# Altium schematic sheet Tarjeta_SD_Interfaz.SchDoc: MSP430F5529_uSD_CARD_Interface
size A4; Date: 13.06.2011; Author: ROUX, Federico G. (rouxfederico@gmail.com); CompanyName: Neróx; DrawnBy: ROUX, Federico G.(rouxfederico@gmail.com); Engineer: ALMARK, Aarón; Organization: Neróx; DocumentNumber: 3; Revision: 1.2; SheetNumber: 3; SheetTotal: 7; ModifiedDate: 25.10.2011; ProjectName: AySA
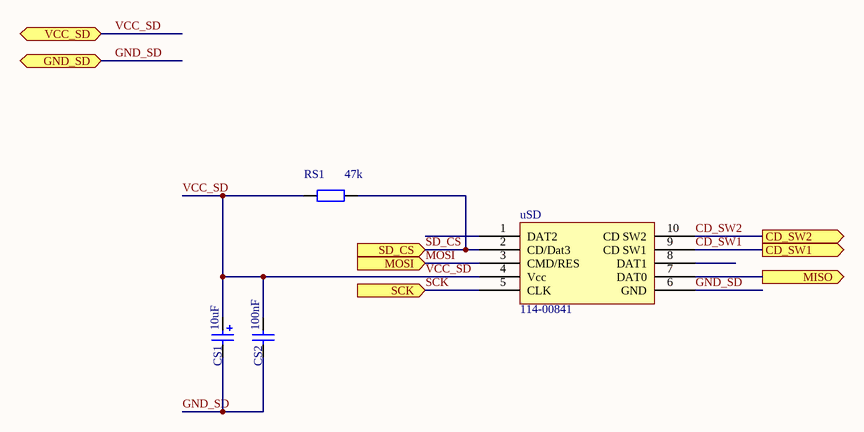
[diagram p0: Tarjeta_SD_Interfaz.SchDoc]

## Parts
CS1  value 10uF  [6-0805_M]  (hidden comment: Cap Pol3)
CS2  value 100nF  [6-0805_M]  (hidden comment: Cap)
RS1  value 47k  [6-0805_M]  (hidden comment: Res2)
uSD  114-00841  [Amphenol 114-00841-68]

## Ports
CD_SW1 (out), CD_SW2 (out), GND_SD, MISO (out), MOSI (in), SCK (in), SD_CS (in), VCC_SD

## Nets
CD_SW1: uSD.9(CD_SW1) ; port CD_SW1
CD_SW2: uSD.10(CD_SW2) ; port CD_SW2
GND_SD: CS1.2 CS2.1 uSD.6(GND) ; port GND_SD
MISO: uSD.7(DAT0) ; port MISO
MOSI: uSD.3(CMD/RES) ; port MOSI
SCK: uSD.5(CLK) ; port SCK
SD_CS: RS1.2 uSD.2(CD/Dat3) ; port SD_CS
VCC_SD: CS1.1 CS2.2 RS1.1 uSD.4(Vcc) ; port VCC_SD

Not connected (* = marked no-connect by the designer): uSD 1(DAT2) 8(DAT1)

## Library data of the parts
CS1 = Cap Pol3: Polarized Capacitor (SMD); Published: 8-Jun-2000; Revision: July-2002: Re-released for DXP Platform.; Publisher: Altium Limited
CS2 = Cap Semi: Capacitor (SMD); Published: 8-Jun-2000; Revision: July-2002: Re-released for DXP Platform.; Publisher: Altium Limited
RS1 = Res2: Resistor(0805 - SMD); Published: 8-Jun-2000; LatestRevisionDate: 17-Jul-2002; LatestRevisionNote: Re-released for DXP Platform.; PackageReference: AXIAL-0.4; Publisher: Altium Limited; PackageDescription: Axial Device, Thru-Hole; 2 Leads; 0.4 in Pin Spacing
uSD = uSD Card Connector Amphenol 114-00841: uSD Card Connector; Manufacturer: Amphenol Shoumin Industry; Part.NO: 114-00841-68; Auth.: ROUX, Federico G.; Mail: rouxfederico@hotmail.com; Company: NEROX SRL; Description: Micro SD None Push Connector Top Mount; Dat.: 25.10.2011; URL: www.amphenol.com